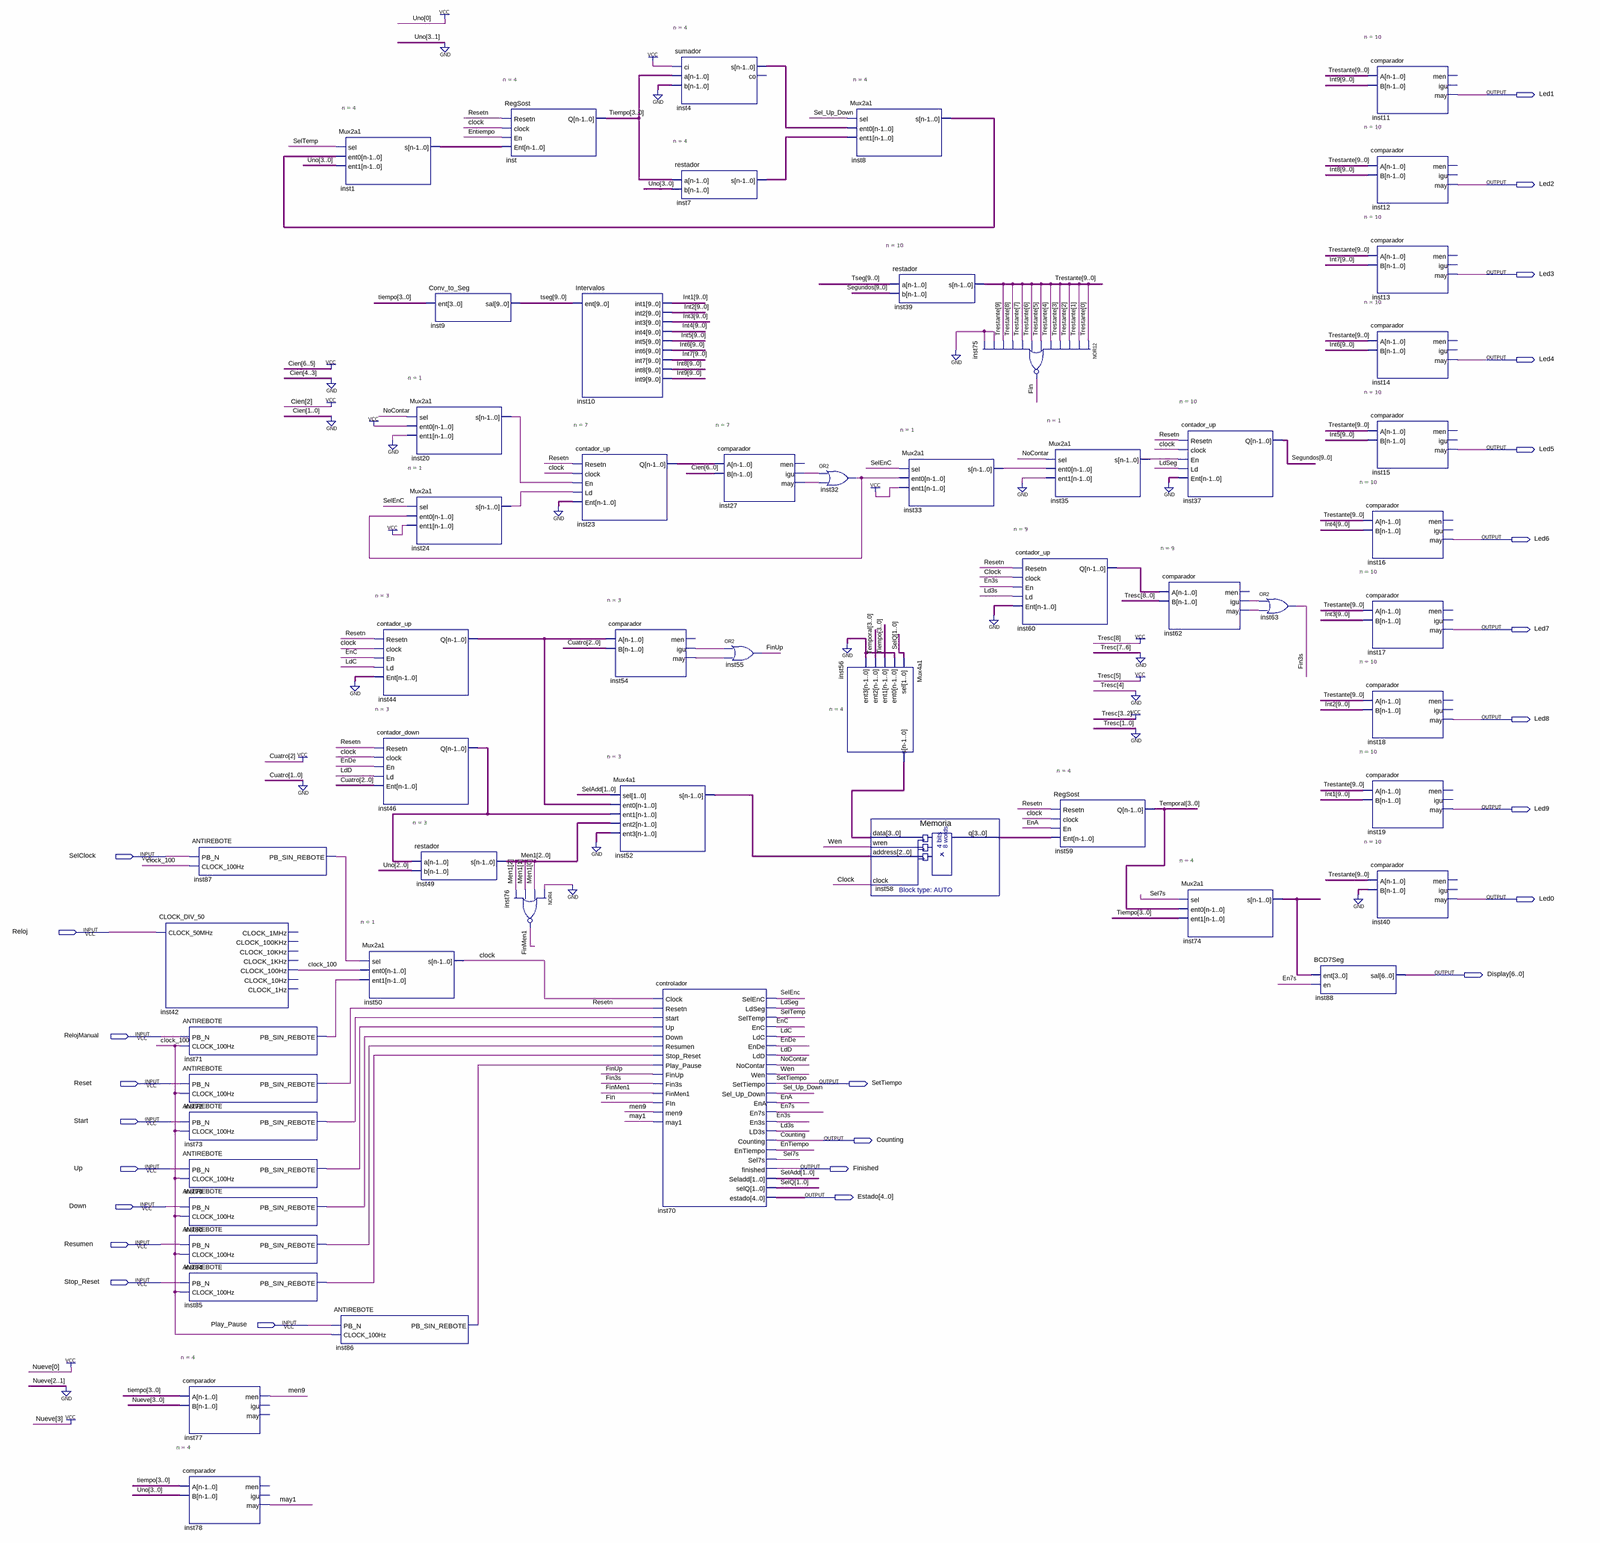
[diagram p0: schematic sheet, whole]
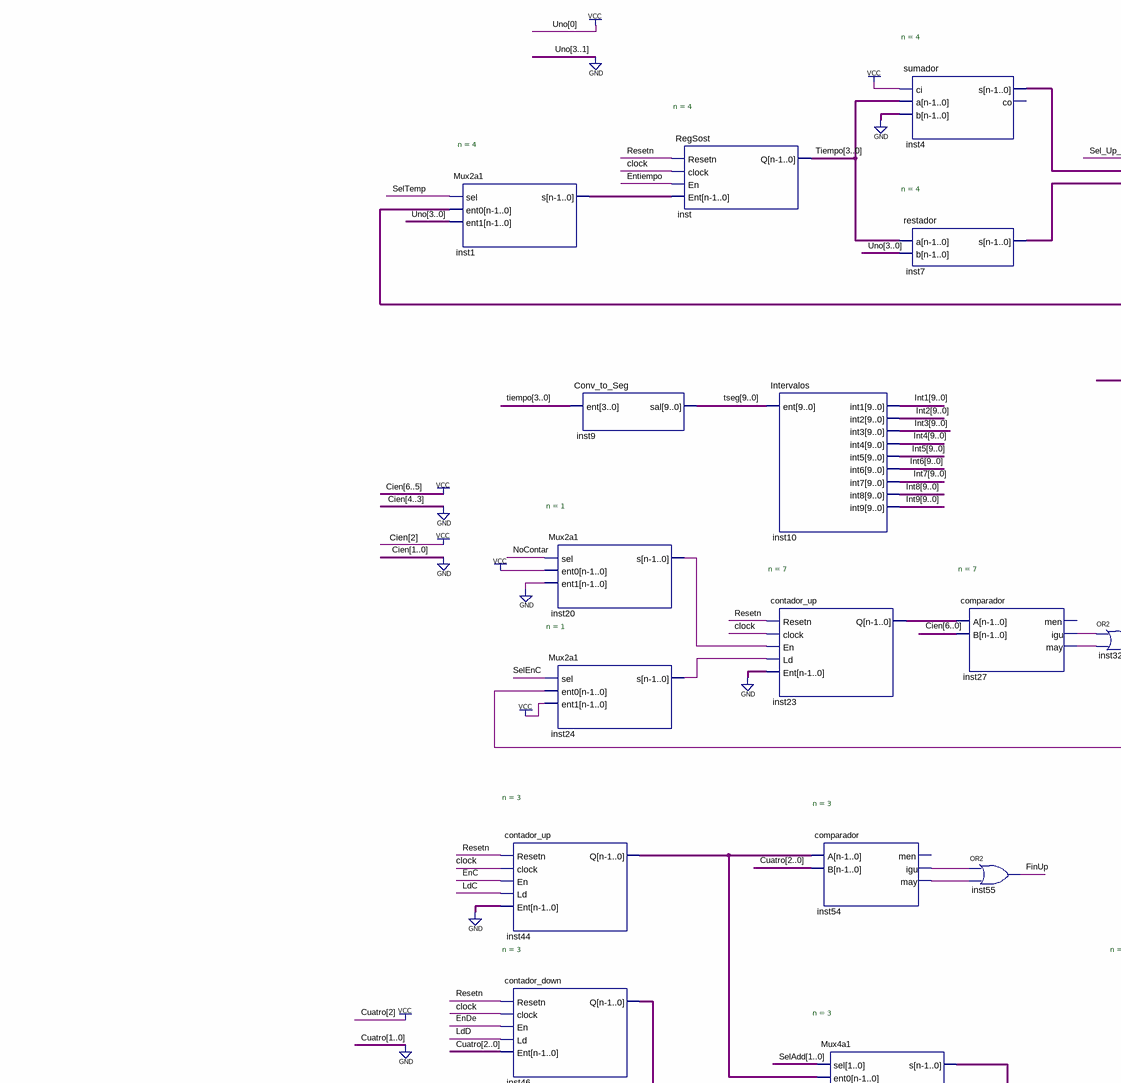
[diagram p1: schematic sheet, upper left part]
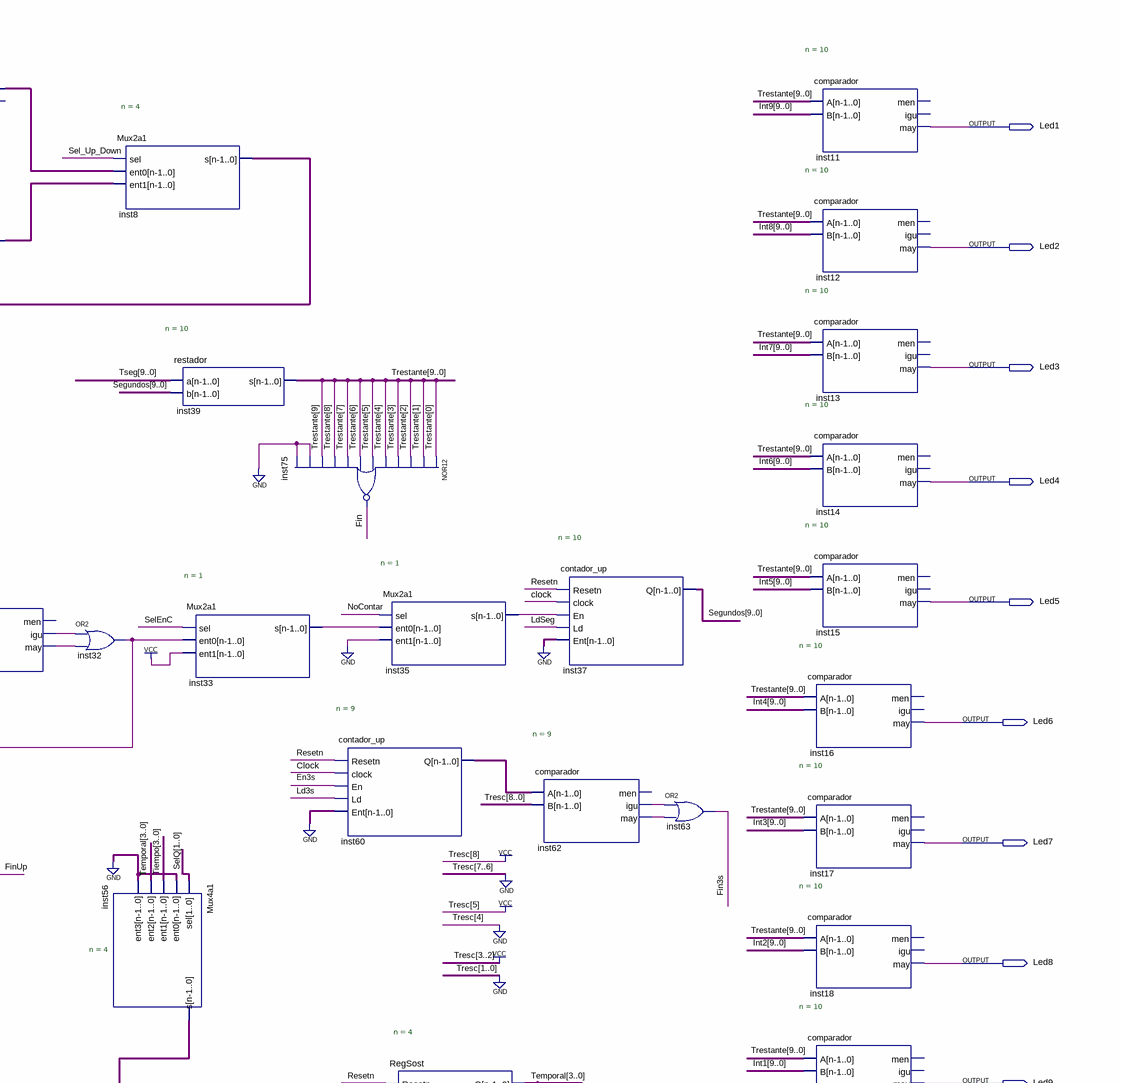
[diagram p2: schematic sheet, upper right part]
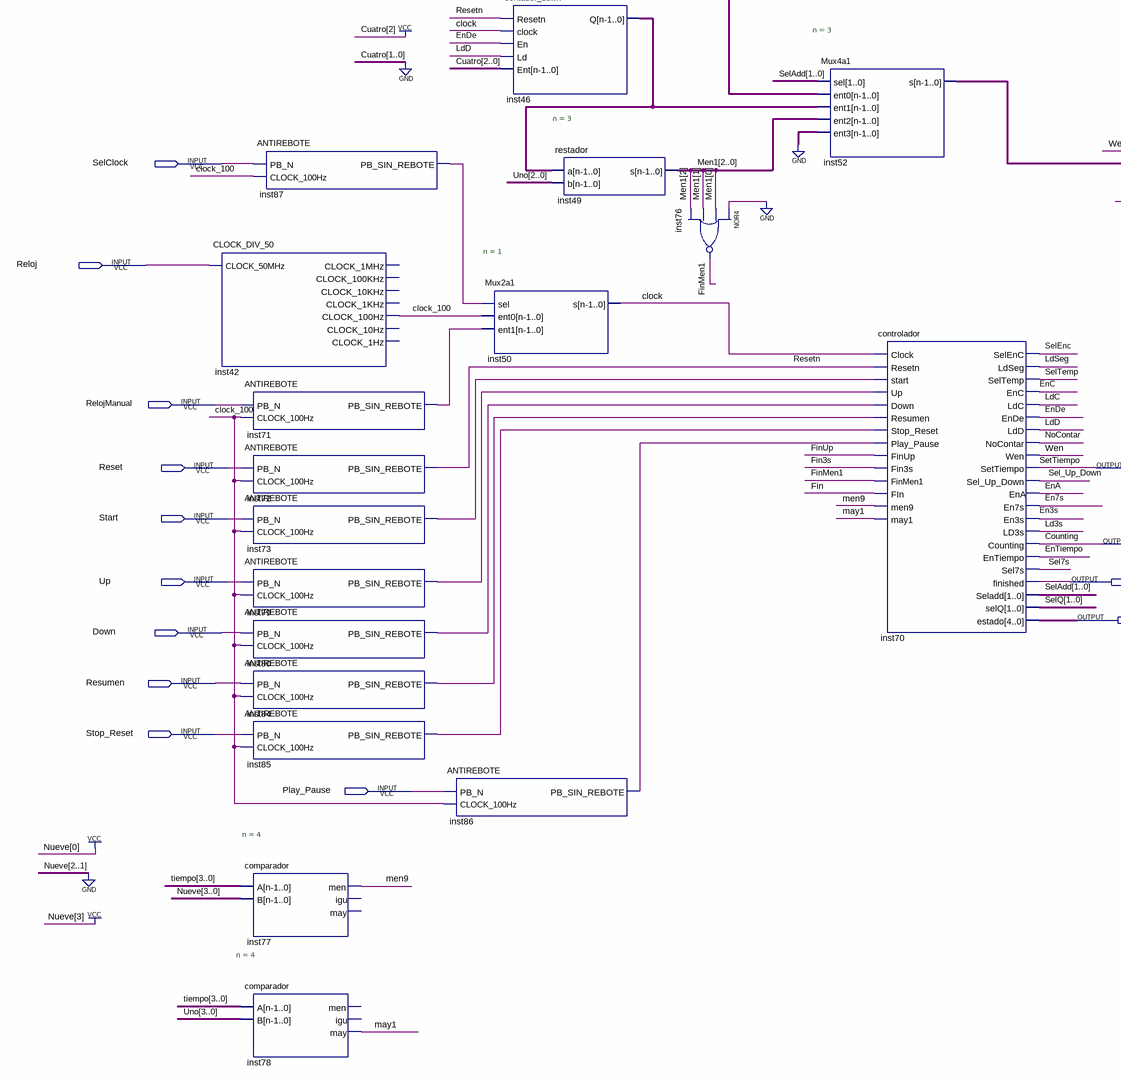
[diagram p3: schematic sheet, lower left part]
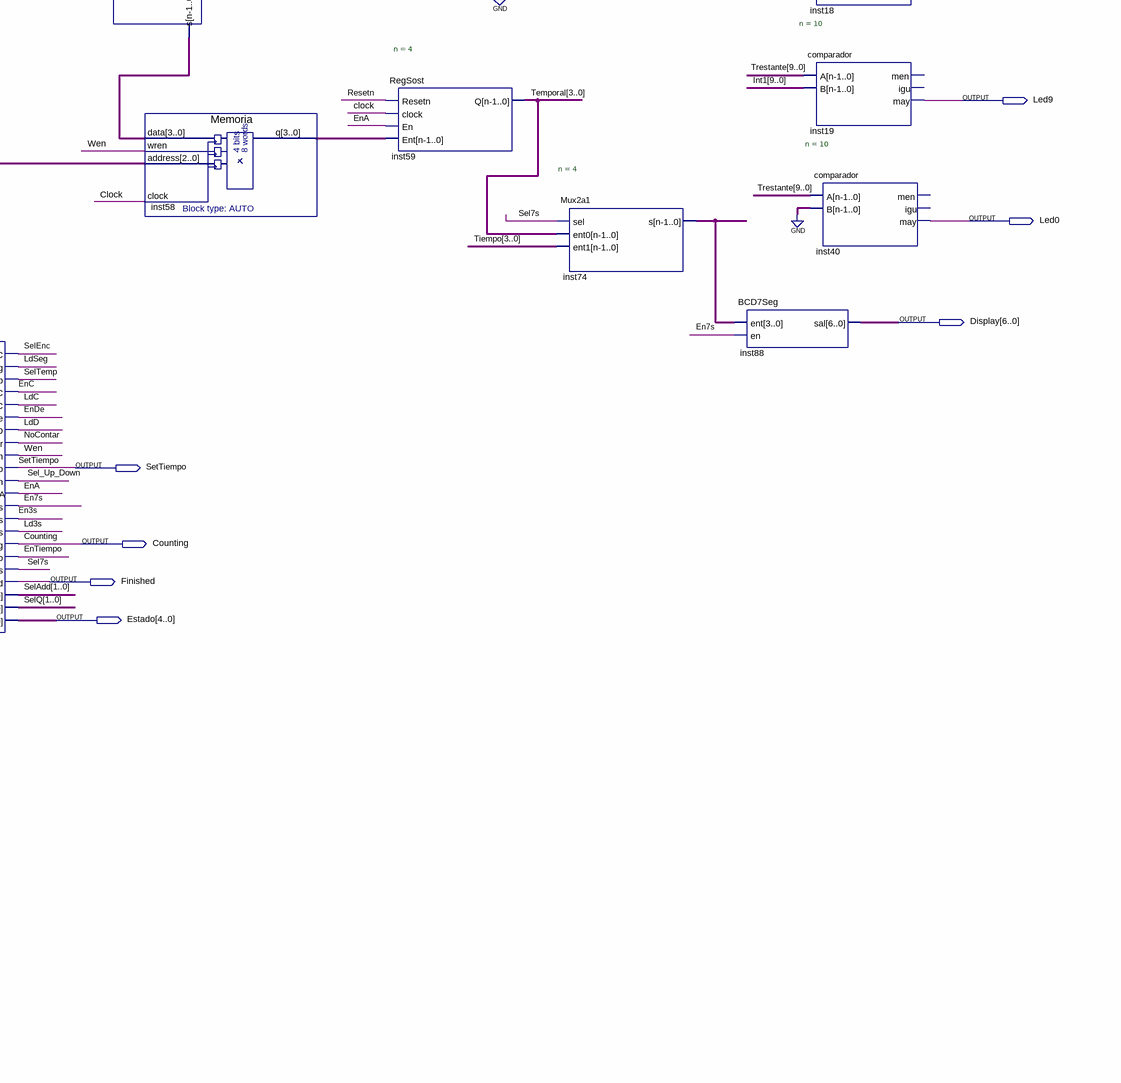
[diagram p4: schematic sheet, lower right part]
// Quartus schematic relojArena.bdf as structural Verilog: 56 symbols, 25 pins
module relojArena (
  input  SelClock,
  input  Reloj,
  input  RelojManual,
  input  Reset,
  input  Start,
  input  Up,
  input  Down,
  input  Resumen,
  input  Stop_Reset,
  input  Play_Pause,
  output Led1,
  output Led2,
  output Led3,
  output Led4,
  output Led5,
  output Led6,
  output Led7,
  output Led8,
  output Led9,
  output Led0,
  output [6:0] Display,
  output SetTiempo,
  output Counting,
  output Finished,
  output [4:0] Estado
);

  wire clock, clock_100, En3s, En7s, EnA, EnC, EnDe, Entiempo, Fin, Fin3s, FinMen1, FinUp, inst20_s,
       inst24_s, inst27_igu, inst27_may, inst32_out, inst33_s, inst35_s, inst54_igu, inst54_may, inst62_igu,
       inst62_may, inst71_pb_sin_rebote, inst73_pb_sin_rebote, inst79_pb_sin_rebote, inst80_pb_sin_rebote,
       inst84_pb_sin_rebote, inst85_pb_sin_rebote, inst86_pb_sin_rebote, inst87_pb_sin_rebote, Ld3s, LdC,
       LdD, LdSeg, may1, men9, NoContar, Resetn, Sel7s, Sel_Up_Down, SelEnC, SelTemp, Wen;
  wire [1:0] SelAdd, SelQ;
  wire [2:0] inst44_q, inst46_q, inst52_s, Men1;
  wire [3:0] inst1_s, inst4_s, inst7_s, inst8_s, inst56_s, inst58_q, inst74_s, Temporal, Tiempo;
  wire [6:0] inst23_q;
  wire [8:0] inst60_q;
  wire [9:0] Int1, Int2, Int3, Int4, Int5, Int6, Int7, Int8, Int9, Segundos, Trestante, tseg;

  CLOCK_DIV_50 inst42 (
    .CLOCK_50MHz(Reloj), .CLOCK_100Hz(clock_100));  // open: CLOCK_1MHz, CLOCK_100KHz, CLOCK_10KHz, CLOCK_1KHz, CLOCK_10Hz, CLOCK_1Hz
  ANTIREBOTE inst71 (.PB_N(RelojManual), .CLOCK_100Hz(clock_100), .PB_SIN_REBOTE(inst71_pb_sin_rebote));
  ANTIREBOTE inst72 (.PB_N(Reset), .CLOCK_100Hz(clock_100), .PB_SIN_REBOTE(Resetn));
  ANTIREBOTE inst73 (.PB_N(Start), .CLOCK_100Hz(clock_100), .PB_SIN_REBOTE(inst73_pb_sin_rebote));
  ANTIREBOTE inst79 (.PB_N(Up), .CLOCK_100Hz(clock_100), .PB_SIN_REBOTE(inst79_pb_sin_rebote));
  ANTIREBOTE inst80 (.PB_N(Down), .CLOCK_100Hz(clock_100), .PB_SIN_REBOTE(inst80_pb_sin_rebote));
  ANTIREBOTE inst84 (.PB_N(Resumen), .CLOCK_100Hz(clock_100), .PB_SIN_REBOTE(inst84_pb_sin_rebote));
  ANTIREBOTE inst85 (.PB_N(Stop_Reset), .CLOCK_100Hz(clock_100), .PB_SIN_REBOTE(inst85_pb_sin_rebote));
  comparador #(.n(4)) inst77 (.A(Tiempo), .B(4'b1001), .men(men9));  // open: igu, may
  comparador #(.n(4)) inst78 (.A(Tiempo), .B(4'b0001), .may(may1));  // open: men, igu
  ANTIREBOTE inst87 (.PB_N(SelClock), .CLOCK_100Hz(clock_100), .PB_SIN_REBOTE(inst87_pb_sin_rebote));
  ANTIREBOTE inst86 (.PB_N(Play_Pause), .CLOCK_100Hz(clock_100), .PB_SIN_REBOTE(inst86_pb_sin_rebote));
  Mux2a1 #(.n(4)) inst1 (.sel(SelTemp), .ent0(inst8_s), .ent1(4'b0001), .s(inst1_s));
  Mux2a1 #(.n(1)) inst50 (.sel(inst87_pb_sin_rebote), .ent0(clock_100), .ent1(inst71_pb_sin_rebote), .s(clock));
  Mux2a1 #(.n(1)) inst20 (.sel(NoContar), .ent0(1'b1), .ent1(1'b0), .s(inst20_s));
  Mux2a1 #(.n(1)) inst24 (.sel(SelEnC), .ent0(inst32_out), .ent1(1'b1), .s(inst24_s));
  contador_up #(.n(3)) inst44 (.Resetn(Resetn), .clock(clock), .En(EnC), .Ld(LdC), .Ent(3'b000), .Q(inst44_q));
  contador_down #(.n(3)) inst46 (.Resetn(Resetn), .clock(clock), .En(EnDe), .Ld(LdD), .Ent(3'b100), .Q(inst46_q));
  Conv_to_Seg inst9 (.ent(Tiempo), .sal(tseg));
  restador #(.n(3)) inst49 (.a(inst46_q), .b(3'b001), .s(Men1));
  RegSost #(.n(4)) inst (.Resetn(Resetn), .clock(clock), .En(Entiempo), .Ent(inst1_s), .Q(Tiempo));
  nor inst76 (FinMen1, 1'b0, Men1[0], Men1[1], Men1[2]);
  Intervalos inst10 (
    .ent(tseg), .int1(Int1), .int2(Int2), .int3(Int3), .int4(Int4), .int5(Int5), .int6(Int6), .int7(Int7),
    .int8(Int8), .int9(Int9));
  contador_up #(.n(7)) inst23 (
    .Resetn(Resetn), .clock(clock), .En(inst20_s), .Ld(inst24_s), .Ent({7{1'b0}}), .Q(inst23_q));
  comparador #(.n(3)) inst54 (.A(inst44_q), .B(3'b100), .igu(inst54_igu), .may(inst54_may));  // open: men
  Mux4a1 #(.n(3)) inst52 (.sel(SelAdd), .ent0(inst44_q), .ent1(inst46_q), .ent2(Men1), .ent3(3'b000), .s(inst52_s));
  sumador #(.n(4)) inst4 (.ci(1'b1), .a(Tiempo), .b(4'b0000), .s(inst4_s));  // open: co
  restador #(.n(4)) inst7 (.a(Tiempo), .b(4'b0001), .s(inst7_s));
  controlador inst70 (
    .Clock(clock), .Resetn(Resetn), .start(inst73_pb_sin_rebote), .Up(inst79_pb_sin_rebote),
    .Down(inst80_pb_sin_rebote), .Resumen(inst84_pb_sin_rebote), .Stop_Reset(inst85_pb_sin_rebote),
    .Play_Pause(inst86_pb_sin_rebote), .FinUp(FinUp), .Fin3s(Fin3s), .FinMen1(FinMen1), .FIn(Fin),
    .men9(men9), .may1(may1), .SelEnC(SelEnC), .LdSeg(LdSeg), .SelTemp(SelTemp), .EnC(EnC), .LdC(LdC),
    .EnDe(EnDe), .LdD(LdD), .NoContar(NoContar), .Wen(Wen), .SetTiempo(SetTiempo), .Sel_Up_Down(Sel_Up_Down),
    .EnA(EnA), .En7s(En7s), .En3s(En3s), .LD3s(Ld3s), .Counting(Counting), .EnTiempo(Entiempo),
    .Sel7s(Sel7s), .finished(Finished), .Seladd(SelAdd), .selQ(SelQ), .estado(Estado));
  comparador #(.n(7)) inst27 (.A(inst23_q), .B(7'b1100100), .igu(inst27_igu), .may(inst27_may));  // open: men
  or inst55 (FinUp, inst54_igu, inst54_may);
  or inst32 (inst32_out, inst27_igu, inst27_may);
  Mux2a1 #(.n(4)) inst8 (.sel(Sel_Up_Down), .ent0(inst4_s), .ent1(inst7_s), .s(inst8_s));
  Mux4a1 #(.n(4)) inst56 (.sel(SelQ), .ent0(4'b0000), .ent1(Tiempo), .ent2(Temporal), .ent3(4'b0000), .s(inst56_s));
  restador #(.n(10)) inst39 (.a(tseg), .b(Segundos), .s(Trestante));
  Mux2a1 #(.n(1)) inst33 (.sel(SelEnC), .ent0(inst32_out), .ent1(1'b1), .s(inst33_s));
  Memoria inst58 (.data(inst56_s), .wren(Wen), .address(inst52_s), .clock(clock), .q(inst58_q));
  nor inst75 (Fin, Trestante[0], Trestante[1], Trestante[2], Trestante[3], Trestante[4], Trestante[5], Trestante[6], Trestante[7], Trestante[8], Trestante[9], 1'b0, 1'b0);
  contador_up #(.n(9)) inst60 (.Resetn(Resetn), .clock(clock), .En(En3s), .Ld(Ld3s), .Ent({9{1'b0}}), .Q(inst60_q));
  Mux2a1 #(.n(1)) inst35 (.sel(NoContar), .ent0(inst33_s), .ent1(1'b0), .s(inst35_s));
  RegSost #(.n(4)) inst59 (.Resetn(Resetn), .clock(clock), .En(EnA), .Ent(inst58_q), .Q(Temporal));
  comparador #(.n(9)) inst62 (.A(inst60_q), .B(9'b100101100), .igu(inst62_igu), .may(inst62_may));  // open: men
  contador_up #(.n(10)) inst37 (
    .Resetn(Resetn), .clock(clock), .En(inst35_s), .Ld(LdSeg), .Ent({10{1'b0}}), .Q(Segundos));
  Mux2a1 #(.n(4)) inst74 (.sel(Sel7s), .ent0(Temporal), .ent1(Tiempo), .s(inst74_s));
  or inst63 (Fin3s, inst62_igu, inst62_may);
  BCD7Seg inst88 (.ent(inst74_s), .en(En7s), .sal(Display));
  comparador #(.n(10)) inst11 (.A(Trestante), .B(Int9), .may(Led1));  // open: men, igu
  comparador #(.n(10)) inst12 (.A(Trestante), .B(Int8), .may(Led2));  // open: men, igu
  comparador #(.n(10)) inst13 (.A(Trestante), .B(Int7), .may(Led3));  // open: men, igu
  comparador #(.n(10)) inst14 (.A(Trestante), .B(Int6), .may(Led4));  // open: men, igu
  comparador #(.n(10)) inst15 (.A(Trestante), .B(Int5), .may(Led5));  // open: men, igu
  comparador #(.n(10)) inst16 (.A(Trestante), .B(Int4), .may(Led6));  // open: men, igu
  comparador #(.n(10)) inst17 (.A(Trestante), .B(Int3), .may(Led7));  // open: men, igu
  comparador #(.n(10)) inst18 (.A(Trestante), .B(Int2), .may(Led8));  // open: men, igu
  comparador #(.n(10)) inst19 (.A(Trestante), .B(Int1), .may(Led9));  // open: men, igu
  comparador #(.n(10)) inst40 (.A(Trestante), .B({10{1'b0}}), .may(Led0));  // open: men, igu
endmodule
